# Altium schematic sheet Schematics_Sheet.SchDoc
size A; SheetNumber: 1; SheetTotal: 1; SPICEModelCacheDYXVWCNP: <root> / <DocumentId>DYXVWCNP</DocumentId> / <CacheFrame Number="0"> / <Model Name="res" Kind="MDL"> / <Text>*Default semiconductor resistor / .MODEL RES R()</Text> / </Model> / <Model Name="zener" Kind="MDL"> / <Text>*ZENER / *Default Zener 10V @ 10mA / *Zener Diode Pinout: A,K / .MODEL ZENER D( BV=10 IBV=10E-3 )</Text> / </Model> / </CacheFrame> / </root>
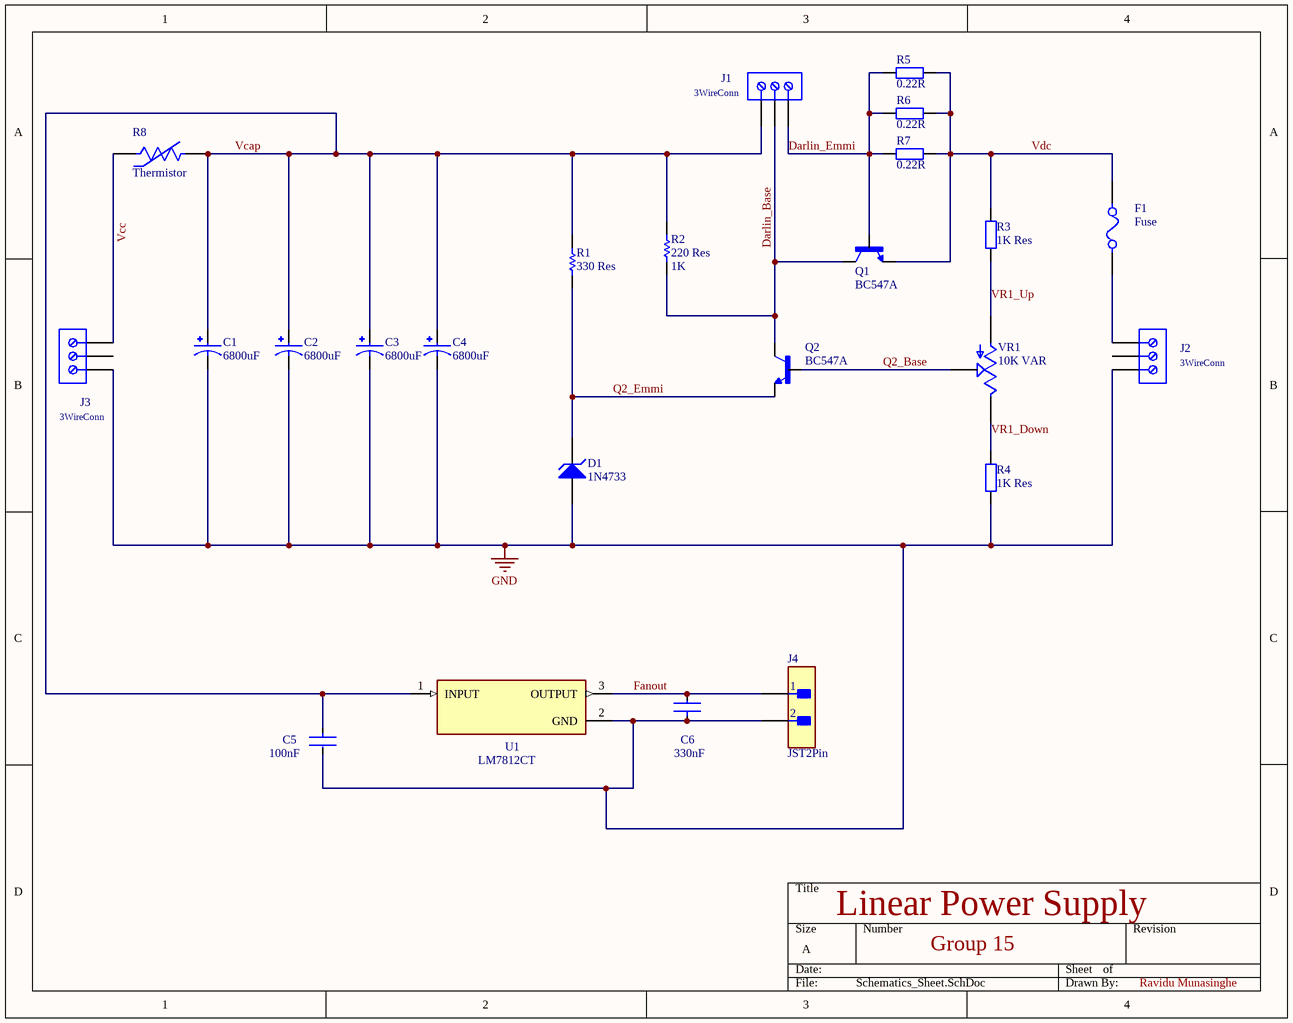
[diagram p0: Schematics_Sheet.SchDoc]

## Parts
C1  6800uF  [Capacitor]
C2  6800uF  [Capacitor]
C3  6800uF  [Capacitor]
C4  6800uF  [Capacitor]
C5  100nF  [capacitor 0.1uf]
C6  330nF  [Cpacitor 0.33uf]
D1  1N4733  [1N4733]
F1  Fuse  [Fuse]
J1  3WireConn  [Connector]
J2  3WireConn  [Connector]
J3  3WireConn  [Connector]
J4  JST2Pin  [JST 2 Pin]
Q1  BC547A  [BC547]
Q2  BC547A  [BC547]
R1  330 Res  [330/470ohm]
R2  220 Res  value 1K  [330/470ohm]
R3  1K Res  [AXIAL-0.4]
R4  1K Res  [AXIAL-0.4]
R5  0.22R  [0.22 Ohm Ceramic Res]
R6  0.22R  [0.22 Ohm Ceramic Res]
R7  0.22R  [0.22 Ohm Ceramic Res]
R8  Thermistor  [Thermistor]
U1  LM7812CT  [Fan_Regulator]
VR1  10K VAR  [Var_Res_Final]

## Nets
GND: C1.2(N) C2.2(N) C3.2(N) C4.2(N) C5.2 C6.1 D1.1(A) J2.3 J3.1 J4.2 R4.1 U1.2(GND)
Darlin_Base: J1.2 Q1.1(C) Q2.1(C) R2.2
Darlin_Emmi: J1.3 Q1.2(B) R5.1 R6.1 R7.1
Fanout: C6.2 J4.1 U1.3(OUTPUT)
Q2_Base: Q2.2(B) VR1.2(WIPER)
Q2_Emmi: D1.2(K) Q2.3(E) R1.2
Vcap: C1.1(P) C2.1(P) C3.1(P) C4.1(P) C5.1 J1.1 R1.1 R2.1 R8.2 U1.1(INPUT)
Vcc: J3.3 R8.1
Vdc: F1.2 Q1.3(E) R3.2 R5.2 R6.2 R7.2
VR1_Down: R4.2 VR1.3(CW)
VR1_Up: R3.1 VR1.1(CCW)
NetF1_1: F1.1 J2.1

Not connected (* = marked no-connect by the designer): J2 2; J3 2

## Notes on the sheet
- Linear Power Supply
- Group 15
- Ravidu Munasinghe

## Library data of the parts
C1-C4 = 493-11046-ND: 6800 µF 35 V Aluminum Electrolytic Capacitors Radial, Can - 2000 Hrs @ 85°C; MP: EEUHD1V681B; MF: Panasonic; Package: RADIAL-2 Panasonic; Availability: In Stock; Value: *; Purchase-URL: https://pricing.snapeda.com/search/part/EEUHD1V681B/?ref=eda; Check_prices: https://www.snapeda.com/parts/EEUHD1V681B/Panasonic/view-part/5784870/?ref=eda; Price: None; SnapEDA_Link: https://www.snapeda.com/parts/EEUHD1V681B/Panasonic/view-part/5784870/?ref=snap
C5 = CMP-06035-052488-1: Cap Ceramic 100nF 100V X7R ±10% Radial 2.5mm +125°C Automotive Ammo Pack; Lead/Base Style: Straight; Lead Diameter: 0.5mm; Termination: Radial; Height: 3.5mm; Capacitance: 100nF; Ratings: AEC-Q200; Max Operating Temperature: 125°C; Min Operating Temperature: -55°C; Case/Package: Radial; Package Quantity: 2000; Resistor Type: Ceramic; Mount: Through Hole; Dielectric: X7R; Lead Free: Lead Free; Height - Seated (Max): 0.138inch; Width: 0.098inch; Tolerance: 10%; Packaging: Tape and Reel; Lead Pitch: 0.098inch; Length: 0.157inch; Voltage Rating: 100V; Voltage Rating (DC): 100V
C6 = CMP-06035-045092-1: Cap Ceramic Monolithic 330nF 100V 10% Thru-Hole Bulk; Dielectric: X7R; Lead/Base Style: Formed Leads; Lead Diameter: 0.5mm; Height: 3.5mm; Height - Seated (Max): 0.138inch; Mount: Through Hole; Voltage Rating (DC): 100V; Resistor Type: Ceramic; Length: 0.157inch; Width: 2.5mm; Max Operating Temperature: 125°C; Package Quantity: 500; Min Operating Temperature: -55°C; Termination: Radial; Lead Pitch: 0.197inch; Capacitance: 330nF; Voltage Rating: 100V; Case/Package: Radial; Packaging: Bulk; Tolerance: 10%; Ratings: AEC-Q200
D1 = D Zener: Zener Diode 5.1V; Published: 8-Jun-2000; LatestRevisionDate: 17-Jul-2002; LatestRevisionNote: Re-released for DXP Platform.; PackageReference: DIODE-0.7; Publisher: Altium Limited; PackageDescription: Diode, Thru-Hole; 2 Leads; 0.7 in Pin Spacing
F1 = CMP-26292-000005-1: FUSE BLOK CARTRIDGE 600V 12A PCB; Manufacturer: Schurter; Manufacturer Part Number: 0031.8231; Voltage Rating Ac: 500V; Number Of Fuses: 1; Fuse Current: 16A; Standoff Height: 0.7mm; Conn Orientation: Horizontal; ComponentLink2URL: https://www.schurter.com/en/datasheet/typ_OGD.pdf; Voltage Rating Dc: 600V; Package: 0; Device Class L3: unset; Digikey Description: FUSE BLOK CARTRIDGE 600V 16A PCB; Mouser Description: Fuse Holder OGD FUSEHOLDER 5X20/6.3X32; Category: Fuse; Device Class L2: Fuse Holders; Height: 12.7mm; ComponentLink2Description: Datasheet; Ambient Temperature Range Low: -40°C; Ambient Temperature Range High: +85°C; Octopart: https://octopart.com/0031.8231-schurter-8659; Automotive: No; RoHS: TRUE; Lead Free: Yes; Device Class L1: Circuit Protection
J1-J3 = CMP-1502-02614-1: Serie 2365 - 5.08 mm Horizontal Cable Entry Modular with Rising Cage Clamp WR-TBL, 3 pin; Manufacturer: Wurth Elektronik; Part Number: 691236510003; Pin Number: 3; Pitch: 5.08mm; Mounting Technology: THT; Datasheet URL: http://katalog.we-online.de/em/datasheet/691236510003.pdf; Publisher: WurthElektronik; Operating Temperature: -30to120degC; Package Reference: 691236510003; Manufacturer URL: http://www.we-online.de; Packaging: Box
J4 = CMP-17439-000031-1: CONN HEADER VERT 2POS 3.96MM; Connector Type: Male Pin; Pitch: 0.156inch; Number of Positions: 2; Packaging: Bulk; Package Quantity: 250; Termination: Solder; Lead Free: Lead Free; Contact Plating: Tin; Contact Type: Male Pin; Color: Natural; Fastening Type: Ramp; Number of Rows: 1; Mount: Through Hole; Series: VH
Q1 Q2 = 2368-BC547A-ND: Bipolar (BJT) Transistor NPN 45 V 100 mA 300MHz 625 mW Through Hole TO-92; MF: ON Semiconductor; Value: *; MP: BC547A; Package: TO-92 NXP Semiconductors; SnapEDA_Link: https://www.snapeda.com/parts/BC547A/ON%20Semiconductor/view-part/805861/?ref=snap; Price: None; Availability: Unavailable
R1 = 2368-F1W133-ND: 330 Ohms ±5% 1W Through Hole Resistor Axial Fusible, Safety; Published: 8-Jun-2000; LatestRevisionDate: 17-Jul-2002; LatestRevisionNote: Re-released for DXP Platform.; PackageReference: AXIAL-0.5; Publisher: Altium Limited; PackageDescription: Axial Device, Thru-Hole; 2 Leads; 0.5 in Pin Spacing
R2 = 470W-1-ND: 220 Ohms ±5% 1W Through Hole Resistor Axial Flame Proof, Safety Metal Oxide Film; Published: 8-Jun-2000; LatestRevisionDate: 17-Jul-2002; LatestRevisionNote: Re-released for DXP Platform.; PackageReference: AXIAL-0.5; Publisher: Altium Limited; PackageDescription: Axial Device, Thru-Hole; 2 Leads; 0.5 in Pin Spacing
R3 R4 = CF14JT1K00TR-ND: 1 kOhms ±5% 0.25W, 1/4W Through Hole Resistor Axial Flame Retardant Coating, Safety Carbon Film; PackageReference: AXIAL-0.4; PackageDescription: Axial Device, Thru-Hole; 2 Leads; 0.4 in Pin Spacing; Published: 8-Jun-2000; LatestRevisionDate: 17-Jul-2002; LatestRevisionNote: Re-released for DXP Platform.; Publisher: Altium Limited
R5-R7 = 280-CR10-0.22-RC: Wirewound Resistors - Through Hole 0.22ohms 5% Tol 7W; Published: 8-Jun-2000; LatestRevisionDate: 17-Jul-2002; LatestRevisionNote: Re-released for DXP Platform.; PackageReference: AXIAL-0.4; Publisher: Altium Limited; PackageDescription: Axial Device, Thru-Hole; 2 Leads; 0.4 in Pin Spacing
R8 = CMP-06022-000249-1: Thermistor PTC 470Ω 2-Pin Screw Mount Radial Bulk; Tolerance: 20%; Voltage: 16V; Current Rating: 100mA; Lead Length: 39mm; Resistance: 100R; Package Quantity: 200; Depth: 3mm; Operating Supply Voltage: 16V; Termination: Radial; Min Operating Temperature: -10°C; Packaging: Bulk; Length: 7.5mm; Number of Pins: 2; Mount: Through Hole; Max Operating Temperature: 130°C; Case/Package: Radial; Max Supply Voltage: 16V; REACH SVHC: No SVHC; Lead Free: Lead Free; Radiation Hardening: No
U1 = CMP-07128-000015-1: IC REG LINEAR 12V 1A TO220-3; Obsolete Part: true; Manufacturer: ON Semiconductor; Nominal Supply Current: 5.1mA; Output Type: Fixed; Dropout Voltage: 2V; Max Supply Voltage: 35V; Accuracy Percentage: 4%; Standoff Height: 2.7mm; Number Of Outputs: 1; Octopart: https://octopart.com/lm7812ct-on+semiconductor-14383031; Output Current: 1A; ComponentLink2Description: Datasheet; Device Class L1: Integrated Circuits (ICs); Device Class L2: Power Management ICs; Temperature Range Low: -40°C; Category: IC; Package: TO220B03; Device Class L3: Voltage Regulators - Linear; RoHS: TRUE; Digikey Description: IC REG LINEAR 12V 1A TO220-3; Ipc Land Pattern Name: TO-220; Output Voltage: 12V; Temperature: -40°C to +125°C; Automotive: No; Temperature Range High: +125°C; ComponentLink2URL: https://www.mouser.in/datasheet/2/308/LM7812-1125088.pdf; Manufacturer Part Number: LM7812CT; Height: 20.4mm; Lead Free: Yes
VR1 = 478-601030-ND: 10 kOhms 0.1W, 1/10W PC Pins Through Hole Trimmer Potentiometer Carbon 1.0 Turn Top Adjustment; MF: Bourns; MP: 3362P-1-503RLF; Package: 3362P-1 Bourns Inc.; Purchase-URL: https://pricing.snapeda.com/search/part/3362P-1-503RLF/?ref=eda; Value: *; Digi-Key_Part_Number: 118-3362P-1-503RLFCT-ND; SnapEDA_Link: https://www.snapeda.com/parts/3362P-1-503RLF/Bourns/view-part/1444210/?ref=snap; Check_prices: https://www.snapeda.com/parts/3362P-1-503RLF/Bourns/view-part/1444210/?ref=eda